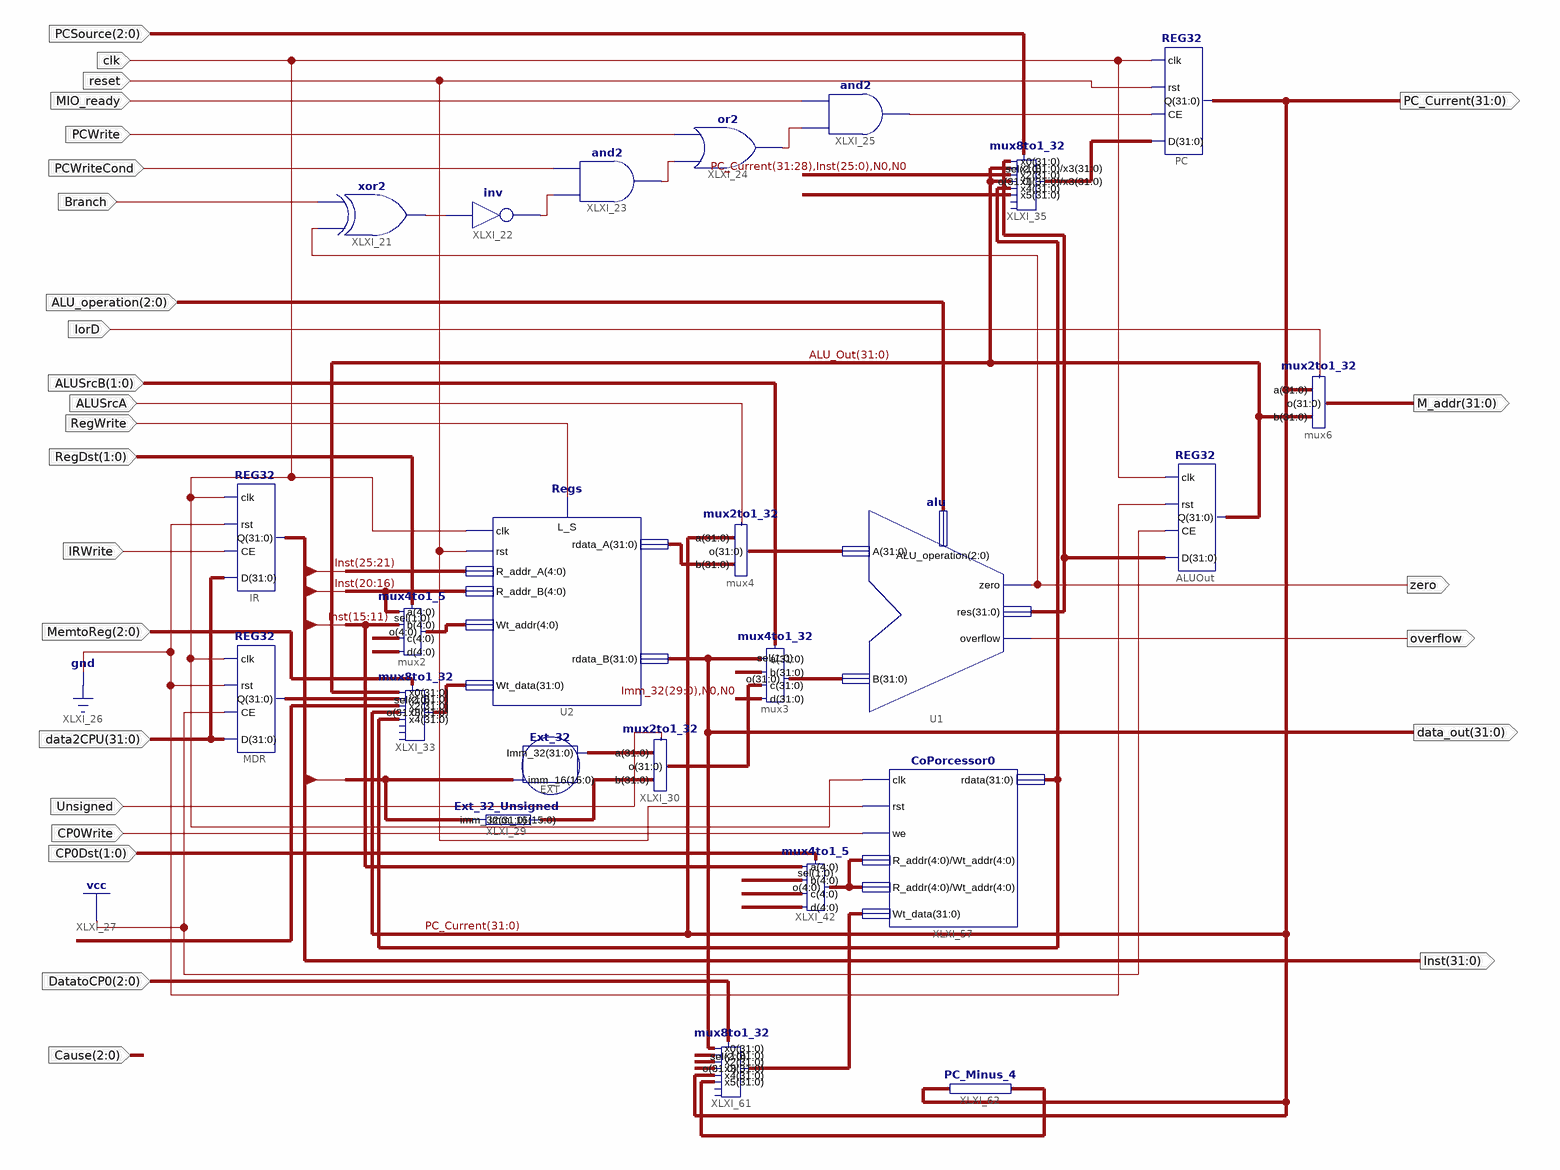
[diagram p0: schematic sheet 1]
// Xilinx ISE schematic Data_path.sch (spartan3e) as structural Verilog: 24 symbols, 27 ports
module Data_path (
  input  clk,
  input  IRWrite,
  input  [31:0] data2CPU,
  input  [2:0] MemtoReg,
  input  [1:0] RegDst,
  input  reset,
  input  RegWrite,
  input  ALUSrcA,
  input  [1:0] ALUSrcB,
  input  Branch,
  input  PCWriteCond,
  input  PCWrite,
  input  MIO_ready,
  input  [2:0] PCSource,
  input  [2:0] ALU_operation,
  input  IorD,
  input  Unsigned,
  input  CP0Write,
  input  [1:0] CP0Dst,
  input  [2:0] Cause,
  input  [2:0] DatatoCP0,
  output [31:0] Inst,
  output [31:0] data_out,
  output zero,
  output overflow,
  output [31:0] PC_Current,
  output [31:0] M_addr
);

  wire XLXN_56, XLXN_61, XLXN_62, XLXN_65, XLXN_70;
  wire [4:0] CP0_addr, Wt_addr;
  wire [31:0] ALU_Out, CP0_out, CP0_WData, Data_in, Imm_32, PC_Previous, Wt_data, XLXN_41, XLXN_42, XLXN_48,
       XLXN_49, XLXN_75, XLXN_103, XLXN_104;

  Regs U2 (
    .clk(clk), .L_S(RegWrite), .rdata_A(XLXN_48), .rst(reset), .Wt_data(Wt_data), .rdata_B(data_out),
    .R_addr_A(Inst[25:21]), .R_addr_B(Inst[20:16]), .Wt_addr(Wt_addr));
  REG32 IR (.D(data2CPU), .CE(IRWrite), .rst(1'b0), .clk(clk), .Q(Inst));
  REG32 MDR (.D(data2CPU), .CE(1'b1), .rst(1'b0), .clk(clk), .Q(Data_in));
  REG32 ALUOut (.D(XLXN_42), .CE(1'b1), .rst(1'b0), .clk(clk), .Q(ALU_Out));
  REG32 PC (.D(XLXN_75), .CE(XLXN_70), .rst(reset), .clk(clk), .Q(PC_Current));
  Ext_32 EXT (.imm_16(Inst[15:0]), .Imm_32(XLXN_104));
  mux4to1_32 mux3 (
    .sel(ALUSrcB), .o(XLXN_41), .a(data_out), .b(32'b00000000000000000000000000000100), .c(Imm_32),
    .d({Imm_32[29:0], 2'b00}));
  xor XLXI_21 (XLXN_56, zero, Branch);
  not XLXI_22 (XLXN_61, XLXN_56);
  and XLXI_23 (XLXN_62, XLXN_61, PCWriteCond);
  or XLXI_24 (XLXN_65, XLXN_62, PCWrite);
  and XLXI_25 (XLXN_70, XLXN_65, MIO_ready);
  mux4to1_5 mux2 (.o(Wt_addr), .a(Inst[20:16]), .b(Inst[15:11]), .c({5{1'b1}}), .d({5{1'b0}}), .sel(RegDst));
  alu U1 (.zero(zero), .res(XLXN_42), .overflow(overflow), .A(XLXN_49), .B(XLXN_41), .ALU_operation(ALU_operation));
  mux2to1_32 mux6 (.sel(IorD), .a(PC_Current), .b(ALU_Out), .o(M_addr));
  mux2to1_32 mux4 (.sel(ALUSrcA), .a(PC_Current), .b(XLXN_48), .o(XLXN_49));
  Ext_32_Unsigned XLXI_29 (.imm_16(Inst[15:0]), .imm_32(XLXN_103));
  mux2to1_32 XLXI_30 (.sel(Unsigned), .a(XLXN_104), .b(XLXN_103), .o(Imm_32));
  mux8to1_32 XLXI_33 (
    .x1(Data_in), .x0(ALU_Out), .x2({Inst[15:0], {16{1'b0}}}), .x3(PC_Current), .x4(CP0_out), .sel(MemtoReg),
    .o(Wt_data));  // open: x5, x6, x7
  mux8to1_32 XLXI_35 (
    .x1(ALU_Out), .x0(XLXN_42), .x2({PC_Current[31:28], Inst[25:0], 2'b00}), .x3(ALU_Out), .x4(CP0_out),
    .x5(32'b00000000000000000000000000101000), .sel(PCSource), .o(XLXN_75));  // open: x6, x7
  mux4to1_5 XLXI_42 (.o(CP0_addr), .a(Inst[15:11]), .b(5'b01100), .c(5'b01101), .d(5'b01110), .sel(CP0Dst));
  CoPorcessor0 XLXI_57 (
    .clk(clk), .rst(reset), .we(CP0Write), .R_addr(CP0_addr), .Wt_addr(CP0_addr), .Wt_data(CP0_WData),
    .rdata(CP0_out));
  mux8to1_32 XLXI_61 (
    .x1({{29{1'b0}}, Cause}), .x0(data_out), .x2({CP0_out[31:1], 1'b1}), .x3({4'b0000, CP0_out[31:4]}),
    .x4(PC_Current), .x5(PC_Previous), .sel(DatatoCP0), .o(CP0_WData));  // open: x6, x7
  PC_Minus_4 XLXI_62 (.PC_Next(PC_Current), .PC_Previous(PC_Previous));
endmodule
